# Altium project HSMM.PrjPcb
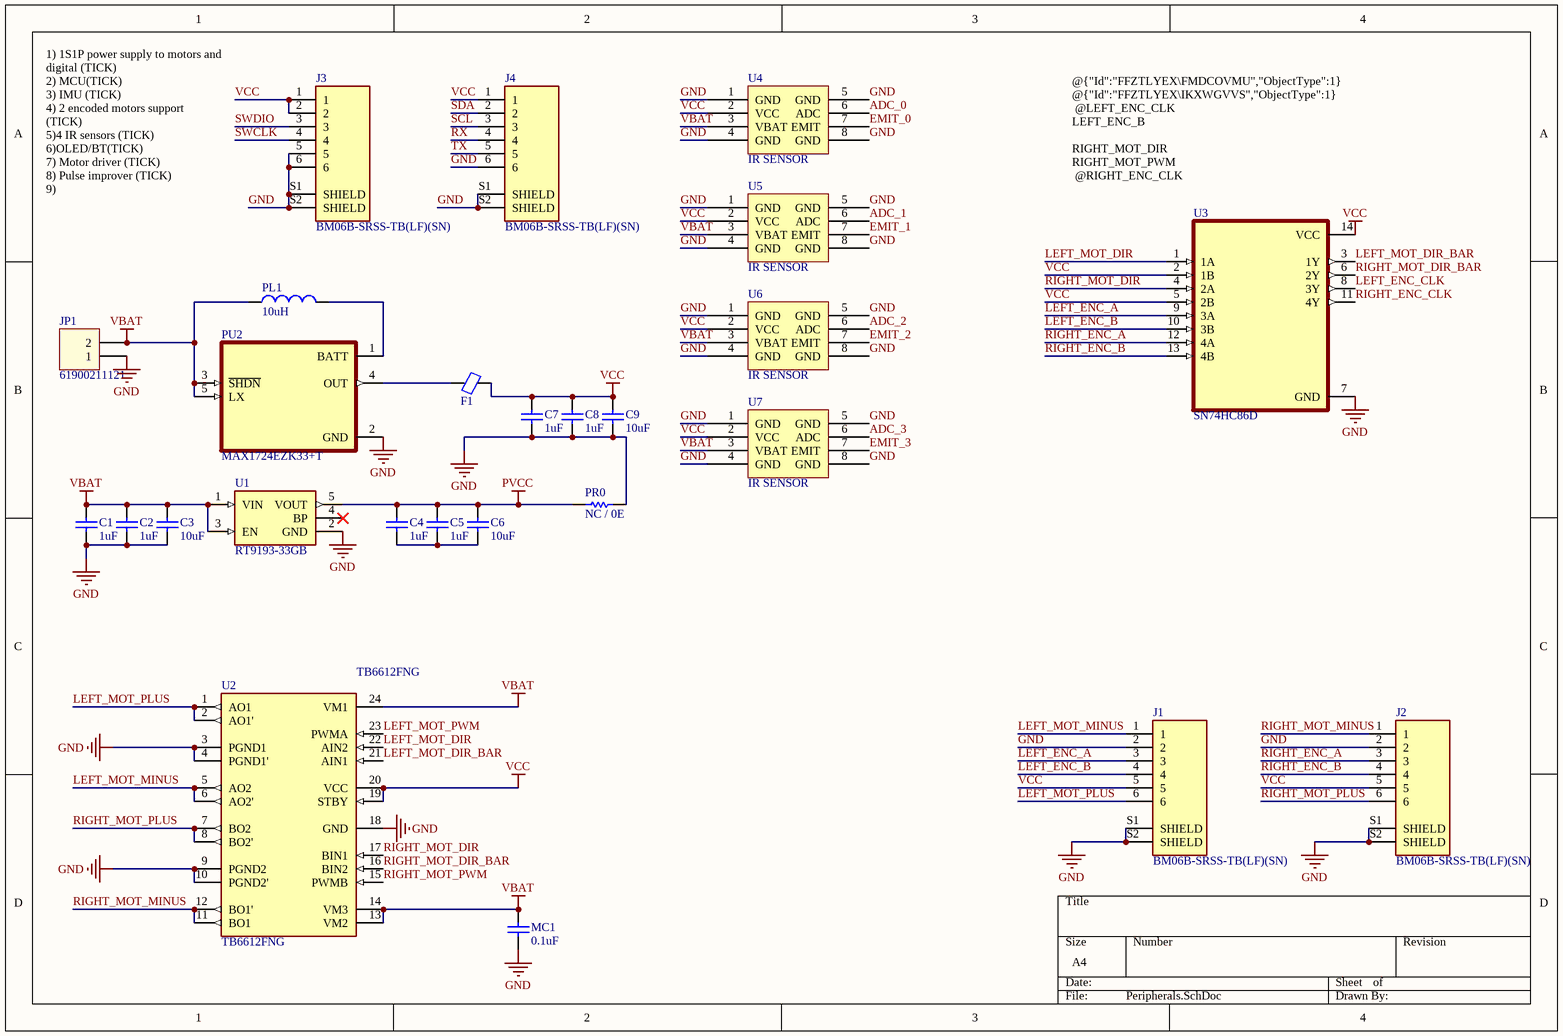
[diagram p0: Peripherals.SchDoc]
2 sheets, 42 parts. Net scope: global (net labels, ports and power ports of the same name join across sheets).
Board file: HSMM.PcbDoc
Sheets:
  Peripherals.SchDoc
  MCU.SchDoc

## Sheet Peripherals.SchDoc
size A4; SheetNumber: 1; SheetTotal: 2

### Parts
C1  1uF  [CAP0603]
C2  1uF  [CAP0603]
C3  10uF  [CAP0603]
C4  1uF  [CAP0603]
C5  1uF  [CAP0603]
C6  10uF  [CAP0603]
C7  1uF  [CAP0603]
C8  1uF  [CAP0603]
C9  10uF  [CAP0603]
F1  Ferrite Bead SMD  [FB0603]  (value not drawn)
J1  BM06B-SRSS-TB(LF)(SN)  [JST_BM06B-SRSS-TB(LF)(SN)]
J2  BM06B-SRSS-TB(LF)(SN)  [JST_BM06B-SRSS-TB(LF)(SN)]
J3  BM06B-SRSS-TB(LF)(SN)  [JST_BM06B-SRSS-TB(LF)(SN)]
J4  BM06B-SRSS-TB(LF)(SN)  [JST_BM06B-SRSS-TB(LF)(SN)]
JP1  61900211121  [61900211121]
MC1  0.1uF  [Cap1206_(3216X18L)Size A]
PL1  10uH  [IND0805]
PR0  NC / 0E  [RESC3413X04N]
PU2  MAX1724EZK33+T  [SOT95P275X110-5N]
U1  RT9193-33GB  [SOT94P279X129-5N]
U2  TB6612FNG  [SSOP24]
U3  SN74HC86D  [SOIC127P600X175-14N]
U4  IR SENSOR  [BLASTER]
U5  IR SENSOR  [BLASTER]
U6  IR SENSOR  [BLASTER]
U7  IR SENSOR  [BLASTER]

### Nets
GND: C1.1 C2.1 C3.1 C7.1 C8.1 C9.1 J1.2 J1.S1(SHIELD) J1.S2(SHIELD) J2.2 J2.S1(SHIELD) J2.S2(SHIELD) J3.5 J3.6 J3.S1(SHIELD) J3.S2(SHIELD) J4.6 J4.S1(SHIELD) J4.S2(SHIELD) JP1.1 MC1.1 PR0.2 PU2.2(GND) U1.2(GND) U2.3(PGND1) U2.4(PGND1') U2.9(PGND2) U2.10(PGND2') U2.18(GND) U3.7(GND) U4.1(GND) U4.4(GND) U4.5(GND) U4.8(GND) U5.1(GND) U5.4(GND) U5.5(GND) U5.8(GND) U6.1(GND) U6.4(GND) U6.5(GND) U6.8(GND) U7.1(GND) U7.4(GND) U7.5(GND) U7.8(GND)
PVCC: C4.2 C5.2 C6.2 PR0.1 U1.5(VOUT)
VBAT: C1.2 C2.2 C3.2 JP1.2 MC1.2 PL1.1 PU2.3(~{SHDN}) PU2.5(LX) U1.1(VIN) U1.3(EN) U2.13(VM2) U2.14(VM3) U2.24(VM1) U4.3(VBAT) U5.3(VBAT) U6.3(VBAT) U7.3(VBAT)
VCC: C7.2 C8.2 C9.2 F1.2 J1.5 J2.5 J3.1 J3.2 J4.1 U2.19(STBY) U2.20(VCC) U3.2(1B) U3.5(2B) U3.14(VCC) U4.2(VCC) U5.2(VCC) U6.2(VCC) U7.2(VCC)
ADC_0: U4.6(ADC)
ADC_1: U5.6(ADC)
ADC_2: U6.6(ADC)
ADC_3: U7.6(ADC)
EMIT_0: U4.7(EMIT)
EMIT_1: U5.7(EMIT)
EMIT_2: U6.7(EMIT)
EMIT_3: U7.7(EMIT)
LEFT_ENC_A: J1.3 U3.9(3A)
LEFT_ENC_B: J1.4 U3.10(3B)
LEFT_ENC_CLK: U3.8(3Y)
LEFT_MOT_DIR: U2.22(AIN2) U3.1(1A)
LEFT_MOT_DIR_BAR: U2.21(AIN1) U3.3(1Y)
LEFT_MOT_MINUS: J1.1 U2.5(AO2) U2.6(AO2')
LEFT_MOT_PLUS: J1.6 U2.1(AO1) U2.2(AO1')
LEFT_MOT_PWM: U2.23(PWMA)
RIGHT_ENC_A: J2.3 U3.12(4A)
RIGHT_ENC_B: J2.4 U3.13(4B)
RIGHT_ENC_CLK: U3.11(4Y)
RIGHT_MOT_DIR: U2.17(BIN1) U3.4(2A)
RIGHT_MOT_DIR_BAR: U2.16(BIN2) U3.6(2Y)
RIGHT_MOT_MINUS: J2.1 U2.11(BO1) U2.12(BO1')
RIGHT_MOT_PLUS: J2.6 U2.7(BO2) U2.8(BO2')
RIGHT_MOT_PWM: U2.15(PWMB)
RX: J4.4
SCL: J4.3
SDA: J4.2
SWCLK: J3.4
SWDIO: J3.3
TX: J4.5
NetC4_1: C4.1 C5.1 C6.1
NetF1_1: F1.1 PU2.4(OUT)
NetPL1_2: PL1.2 PU2.1(BATT)

Not connected (* = marked no-connect by the designer): U1 4(BP)*

### Notes on the sheet
- @{"Id":"FFZTLYEX\FMDCOVMU","ObjectType":1}
  @{"Id":"FFZTLYEX\IKXWGVVS","ObjectType":1}
  @LEFT_ENC_CLK
  LEFT_ENC_B
  RIGHT_MOT_DIR
  RIGHT_MOT_PWM
  @RIGHT_ENC_CLK
  @{"Id":"FFZTLYEX\EYWVHBRG","ObjectType":1}
- 1) 1S1P power supply to motors and digital (TICK)
  2) MCU(TICK)
  3) IMU (TICK)
  4) 2 encoded motors support (TICK)
  5)4 IR sensors (TICK)
  6)OLED/BT(TICK)
  7) Motor driver (TICK)
  8) Pulse improver (TICK)
  9)

### Library data of the parts
C1-C9 = CAP SMD PACKAGE: 0603 CAPACITOR SMD; Designer: Abbas Basereh; Desc.: CAP SMD TOTAL PACKAGES; VALUE: 100nF; Data: 2017-3-10
F1 = Ferrite Bead SMD Package: 0603 FERRITE; Designer: Ali Hafizi
JP1 = 61900211121: WR-WTB 2.54mm Male Locking Header, 2p; Pin Number: 2; ComponentLink1Description: Manufacturer; ComponentLink1URL: http://www.we-online.de; ComponentLink2Description: Datasheet; ComponentLink2URL: http://katalog.we-online.de/em/datasheet/6190xx11121.pdf; Part Number: 61900211121; Published Date: June 2017; Publisher: Wurth Elektronik; Pitch: 2.54 mm
MC1 = CAP SMD PACKAGE: TOTAL CAPACITOR SMD PACK; Designer: Abbas Basereh; Desc.: CAP SMD TOTAL PACKAGES; VALUE: 100nF; Data: 2017-3-10
PL1 = INDUCTOR SMD PACKAGE: TOTAL INDUCTOR SMD PACK; Designer: Abbas Basereh; Desc.: INDUCTOR  SMD TOTAL PACKAGES; VALUE: 1u; Data: 2017-3-10
PR0 = RES 0805 0.125W: RES 0805; Designer: Abbas Basereh; Desc.: RES SMD 0805; Data: 16-12-2016
PU2 = MAX1724EZK33+T: Boost Switching Regulator IC Positive Fixed 3.3V 1 Output 400mA _Switch_ SOT-23-5 Thin, TSOT-23-5; MF: Maxim Integrated; Value: *; SnapEDA_Link: https://www.snapeda.com/parts/MAX1724EZK33%2BT/Maxim%20Integrated/view-part/571456/?ref=snap; Package: SOT-23-5 Maxim; MP: MAX1724EZK33+T; Availability: Unavailable; Price: None
U1 = RT9193-33GB: Linear Voltage Regulator IC Positive Fixed 1 Output 300mA TSOT-23-5; MF: Richtek USA; SnapEDA_Link: https://www.snapeda.com/parts/RT9193-33GB/Richtek+USA+Inc./view-part/?ref=snap; Package: SOT-23-5 Richtek; MP: RT9193-33GB; Check_prices: https://www.snapeda.com/parts/RT9193-33GB/Richtek+USA+Inc./view-part/?ref=eda; Purchase-URL: https://pricing.snapeda.com/search/part/RT9193-33GB/?ref=eda; Digi-Key_Part_Number: 1028-1014-2-ND; Value: *
U2 = TB6612FNG: - Motor Driver Power MOSFET Parallel 24-SSOP; MF: Toshiba; SnapEDA_Link: https://www.snapeda.com/parts/TB6612FNG/Toshiba/view-part/?ref=snap; Package: None; Value: *; MP: TB6612FNG; Check_prices: https://www.snapeda.com/parts/TB6612FNG/Toshiba/view-part/?ref=eda
U3 = SN74HC86D: Quadruple 2-Input Exclusive-OR Gates 14-SOIC -40 to 85; MF: Texas Instruments; Package: SOIC-14 Texas Instruments; Digi-Key_Part_Number: 2156-SN74HC86DRE4-ND; Check_prices: https://www.snapeda.com/parts/SN74HC86D/Texas%20Instruments/view-part/249677/?ref=eda; Purchase-URL: https://pricing.snapeda.com/search/part/SN74HC86D/?ref=eda; SnapEDA_Link: https://www.snapeda.com/parts/SN74HC86D/Texas%20Instruments/view-part/249677/?ref=snap; Value: *; MP: SN74HC86D
U4-U7 = Blaster
J1-J4 = BM06B-SRSS-TB(LF)(SN): Package: None; Price: None; Value: *; MP: BM06B-SRSS-TB(LF)(SN); Availability: Unavailable

## Sheet MCU.SchDoc
size 381 x 381 mm; SheetNumber: 2; SheetTotal: 2
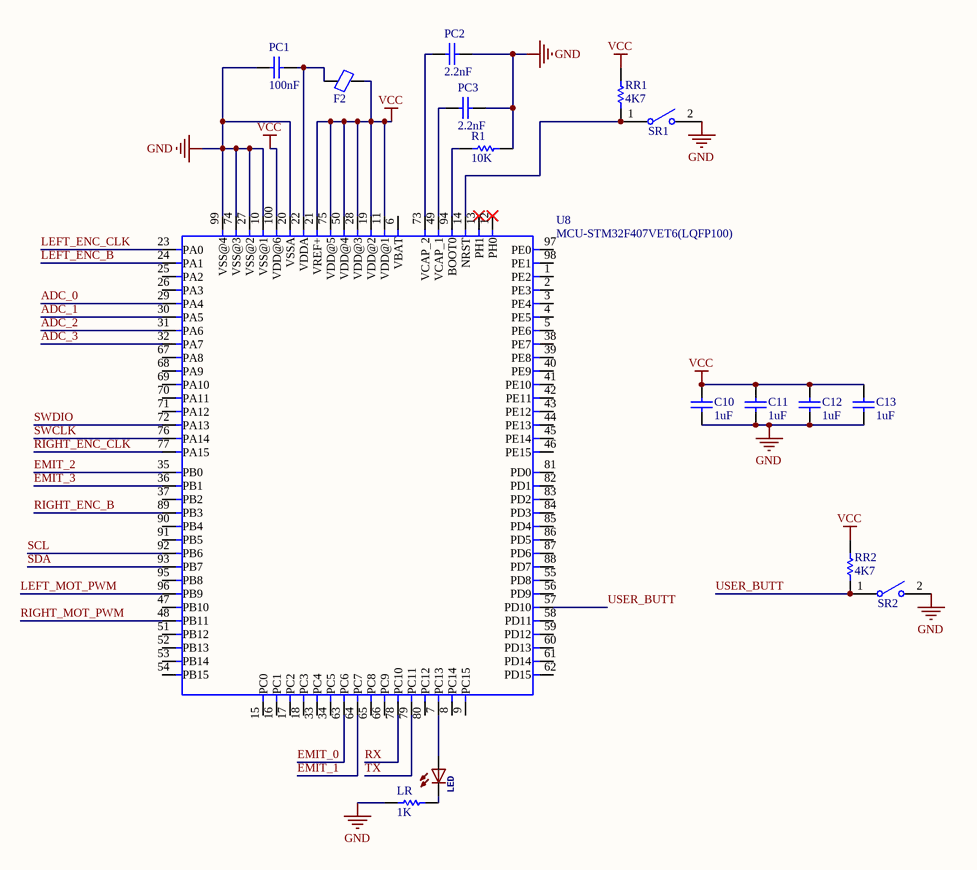
[diagram p1: MCU.SchDoc]

### Parts
C10  1uF  [CAP0603]
C11  1uF  [CAP0603]
C12  1uF  [CAP0603]
C13  1uF  [CAP0603]
F2  Ferrite Bead SMD  [FB0603]  (value not drawn)
LED  LED   OSRAM: - CHIPLED LG R971, LG N971, LY N971, LG Q971, LY Q971, LO R971, LY R971 LH N974, LH R974 LS Q976, LO Q976, LY Q976 LO Q996 - Hyper CHIPLED LW Q18S LB Q993, LB Q99A, LB R99A - SideLED LS A670, LO A670, LY A670, LG A670, LP A670 LB A673, LV A673, LT A673, LW A673 LH A674 LY A675 LS A676, LA A676, LO A676, LY A676, LW A676 LS A679, LY A679, LG A679 -  Hyper Micro SIDELEDÂ® LS Y876, LA Y876, LO Y876, LY Y876 LT Y87S - SmartLED LW L88C, LW L88S LB L89C, LB L89S, LG L890 LS L89K, LO L89K, LY L89K LS L896, LA L896, LO L896, LY L896 - TOPLED LS T670, LO T670, LY T670, LG T670, LP T670 LSG T670, LSP T670, LSY T670, LOP T670, LYG T670 LG T671, LOG T671, LSG T671 LB T673, LV T673, LT T673, LW T673 LH T674 LS T676, LA T676, LO T676, LY T676, LB T676, LH T676, LSB T676, LW T676 LB T67C, LV T67C, LT T67C, LS T67K, LO T67K, LY T67K, LW E67C LS E67B, LA E67B, LO E67B, LY E67B, LB E67C, LV E67C, LT E67C LW T67C LS T679, LY T679, LG T679 LS T770, LO T770, LY T770, LG T770, LP T770 LB T773, LV T773, LT T773, LW T773 LH T774 LS E675, LA E675, LY E675, LS T675 LS T776, LA T776, LO T776, LY T776, LB T776 LHGB T686 LT T68C, LB T68C - Hyper Mini TOPLEDÂ® LB M676 - Mini TOPLED SantanaÂ® LG M470 LS M47K, LO M47K, LY M47K    Source: http://www.osram.convergy.de/  [CHIPLED_0603]  (value not drawn)
LR  1K  [RES0603]
PC1  100nF  [CAP0603]
PC2  2.2nF  [CAP0603]
PC3  2.2nF  [CAP0603]
R1  10K  [RES0603]
RR1  4K7  [RES0603]
RR2  4K7  [RES0603]
SR1  434113050826  [4341x30508x6_6x3.5x5]  (value not drawn)
SR2  434113050826  [4341x30508x6_6x3.5x5]  (value not drawn)
U8  MCU-STM32F407VET6(LQFP100)  [LQFP100-0.5-13.8X13.8MM]

### Nets
GND: C10.1 C11.1 C12.1 C13.1 LR.2 PC1.2 PC2.1 PC3.1 R1.1 SR1.2 SR2.2 U8.10(VSS@1) U8.20(VSSA) U8.27(VSS@2) U8.74(VSS@3) U8.99(VSS@4)
VCC: C10.2 C11.2 C12.2 C13.2 F2.2 RR1.2 RR2.2 U8.11(VDD@1) U8.19(VDD@2) U8.21(VREF+) U8.28(VDD@3) U8.50(VDD@4) U8.75(VDD@5) U8.100(VDD@6)
ADC_0: U8.29(PA4)
ADC_1: U8.30(PA5)
ADC_2: U8.31(PA6)
ADC_3: U8.32(PA7)
EMIT_0: U8.63(PC6)
EMIT_1: U8.64(PC7)
EMIT_2: U8.35(PB0)
EMIT_3: U8.36(PB1)
LEFT_ENC_B: U8.24(PA1)
LEFT_ENC_CLK: U8.23(PA0)
LEFT_MOT_PWM: U8.96(PB9)
RIGHT_ENC_B: U8.89(PB3)
RIGHT_ENC_CLK: U8.77(PA15)
RIGHT_MOT_PWM: U8.48(PB11)
RX: U8.78(PC10)
SCL: U8.92(PB6)
SDA: U8.93(PB7)
SWCLK: U8.76(PA14)
SWDIO: U8.72(PA13)
TX: U8.79(PC11)
USER_BUTT: RR2.1 SR2.1 U8.57(PD10)
NetF2_1: F2.1 PC1.1 U8.22(VDDA)
NetLED_A: LED.A U8.7(PC13)
NetLED_C: LED.C LR.1
NetPC2_2: PC2.2 U8.73(VCAP_2)
NetPC3_2: PC3.2 U8.49(VCAP_1)
NetR1_2: R1.2 U8.94(BOOT0)
NetRR1_1: RR1.1 SR1.1 U8.14(NRST)

Not connected (* = marked no-connect by the designer): U8 1(PE2) 2(PE3) 3(PE4) 4(PE5) 5(PE6) 6(VBAT) 8(PC14) 9(PC15) 12(PH0)* 13(PH1)* 15(PC0) 16(PC1) 17(PC2) 18(PC3) 25(PA2) 26(PA3) 33(PC4) 34(PC5) 37(PB2) 38(PE7) 39(PE8) 40(PE9) 41(PE10) 42(PE11) 43(PE12) 44(PE13) 45(PE14) 46(PE15) 47(PB10) 51(PB12) 52(PB13) 53(PB14) 54(PB15) 55(PD8) 56(PD9) 58(PD11) 59(PD12) 60(PD13) 61(PD14) 62(PD15) 65(PC8) 66(PC9) 67(PA8) 68(PA9) 69(PA10) 70(PA11) 71(PA12) 80(PC12) 81(PD0) 82(PD1) 83(PD2) 84(PD3) 85(PD4) 86(PD5) 87(PD6) 88(PD7) 90(PB4) 91(PB5) 95(PB8) 97(PE0) 98(PE1)

### Library data of the parts
C10-C13 = CAP SMD PACKAGE: as C1 on sheet Peripherals; Data: 2017-3-10
F2 = Ferrite Bead SMD Package: Designer: Ali Hafizi
LED = LEDCHIPLED_0603
LR R1 = RES SMD PACKAGE: TOTAL SMD RESISTOR PACK; Designer: Abbas Basereh; Desc.: RES SMD PAKAGES; Data: 2017-3-10
PC1 = CAP SMD PACKAGE: TOTAL CAPACITOR SMD PACK; Designer: Abbas Basereh; Desc.: CAP SMD TOTAL PACKAGES; Data: 2017-3-10; VALUE: 100nF
PC2 PC3 = CAP SMD PACKAGE: as MC1 on sheet Peripherals; Data: 2017-3-10
RR1 RR2 = RES SMD PACKAGE: 0603 RESISTOR; Designer: Abbas Basereh; Desc.: RES SMD PAKAGES; Data: 2017-3-10
SR1 SR2 = 434113050826: WS-TASV 6.0x3.5mm Tact Switch, J-Bend SMD version; Operation Force: 260g; ComponentLink1Description: Manufacturer; ComponentLink1URL: http://www.we-online.de; ComponentLink2Description: Datasheet; ComponentLink2URL: http://katalog.we-online.de/em/datasheet/4341x3xxx8x6.pdf; Part Number: 434113050826; Published Date: June 2017; Publisher: Wurth Elektronik; Life Cycle: 30000 cycles; Size: 6x3.5x5 mm
U8 = MCU-STM32F407VET6(LQFP100): ARMÂ® CortexÂ®-M4 STM32F4 Microcontroller IC 32-Bit 168MHz 512KB _512K x 8_ FLASH 100-LQFP _14x14_; MF: STMicroelectronics; Package: LQFP-100 STMicroelectronics; Value: *; Price: None; MP: STM32F407VET6; Availability: Unavailable; SnapEDA_Link: https://www.snapeda.com/parts/STM32F407VET6/STMicroelectronics/view-part/45214/?ref=snap

## Nets that join several sheets
GND: Peripherals (46 pins), MCU (16 pins)
VCC: Peripherals (18 pins), MCU (14 pins)
ADC_0: Peripherals (U4.6), MCU (U8.29)
ADC_1: Peripherals (U5.6), MCU (U8.30)
ADC_2: Peripherals (U6.6), MCU (U8.31)
ADC_3: Peripherals (U7.6), MCU (U8.32)
EMIT_0: Peripherals (U4.7), MCU (U8.63)
EMIT_1: Peripherals (U5.7), MCU (U8.64)
EMIT_2: Peripherals (U6.7), MCU (U8.35)
EMIT_3: Peripherals (U7.7), MCU (U8.36)
LEFT_ENC_B: Peripherals (J1.4 U3.10), MCU (U8.24)
LEFT_ENC_CLK: Peripherals (U3.8), MCU (U8.23)
LEFT_MOT_PWM: Peripherals (U2.23), MCU (U8.96)
RIGHT_ENC_B: Peripherals (J2.4 U3.13), MCU (U8.89)
RIGHT_ENC_CLK: Peripherals (U3.11), MCU (U8.77)
RIGHT_MOT_PWM: Peripherals (U2.15), MCU (U8.48)
RX: Peripherals (J4.4), MCU (U8.78)
SCL: Peripherals (J4.3), MCU (U8.92)
SDA: Peripherals (J4.2), MCU (U8.93)
SWCLK: Peripherals (J3.4), MCU (U8.76)
SWDIO: Peripherals (J3.3), MCU (U8.72)
TX: Peripherals (J4.5), MCU (U8.79)